# EAGLE design Versie 3 (EAGLE 7.3.0)
CNAME: PCB Christmas tree; CREVISION: 4; DESIGNER: Balint Balazs
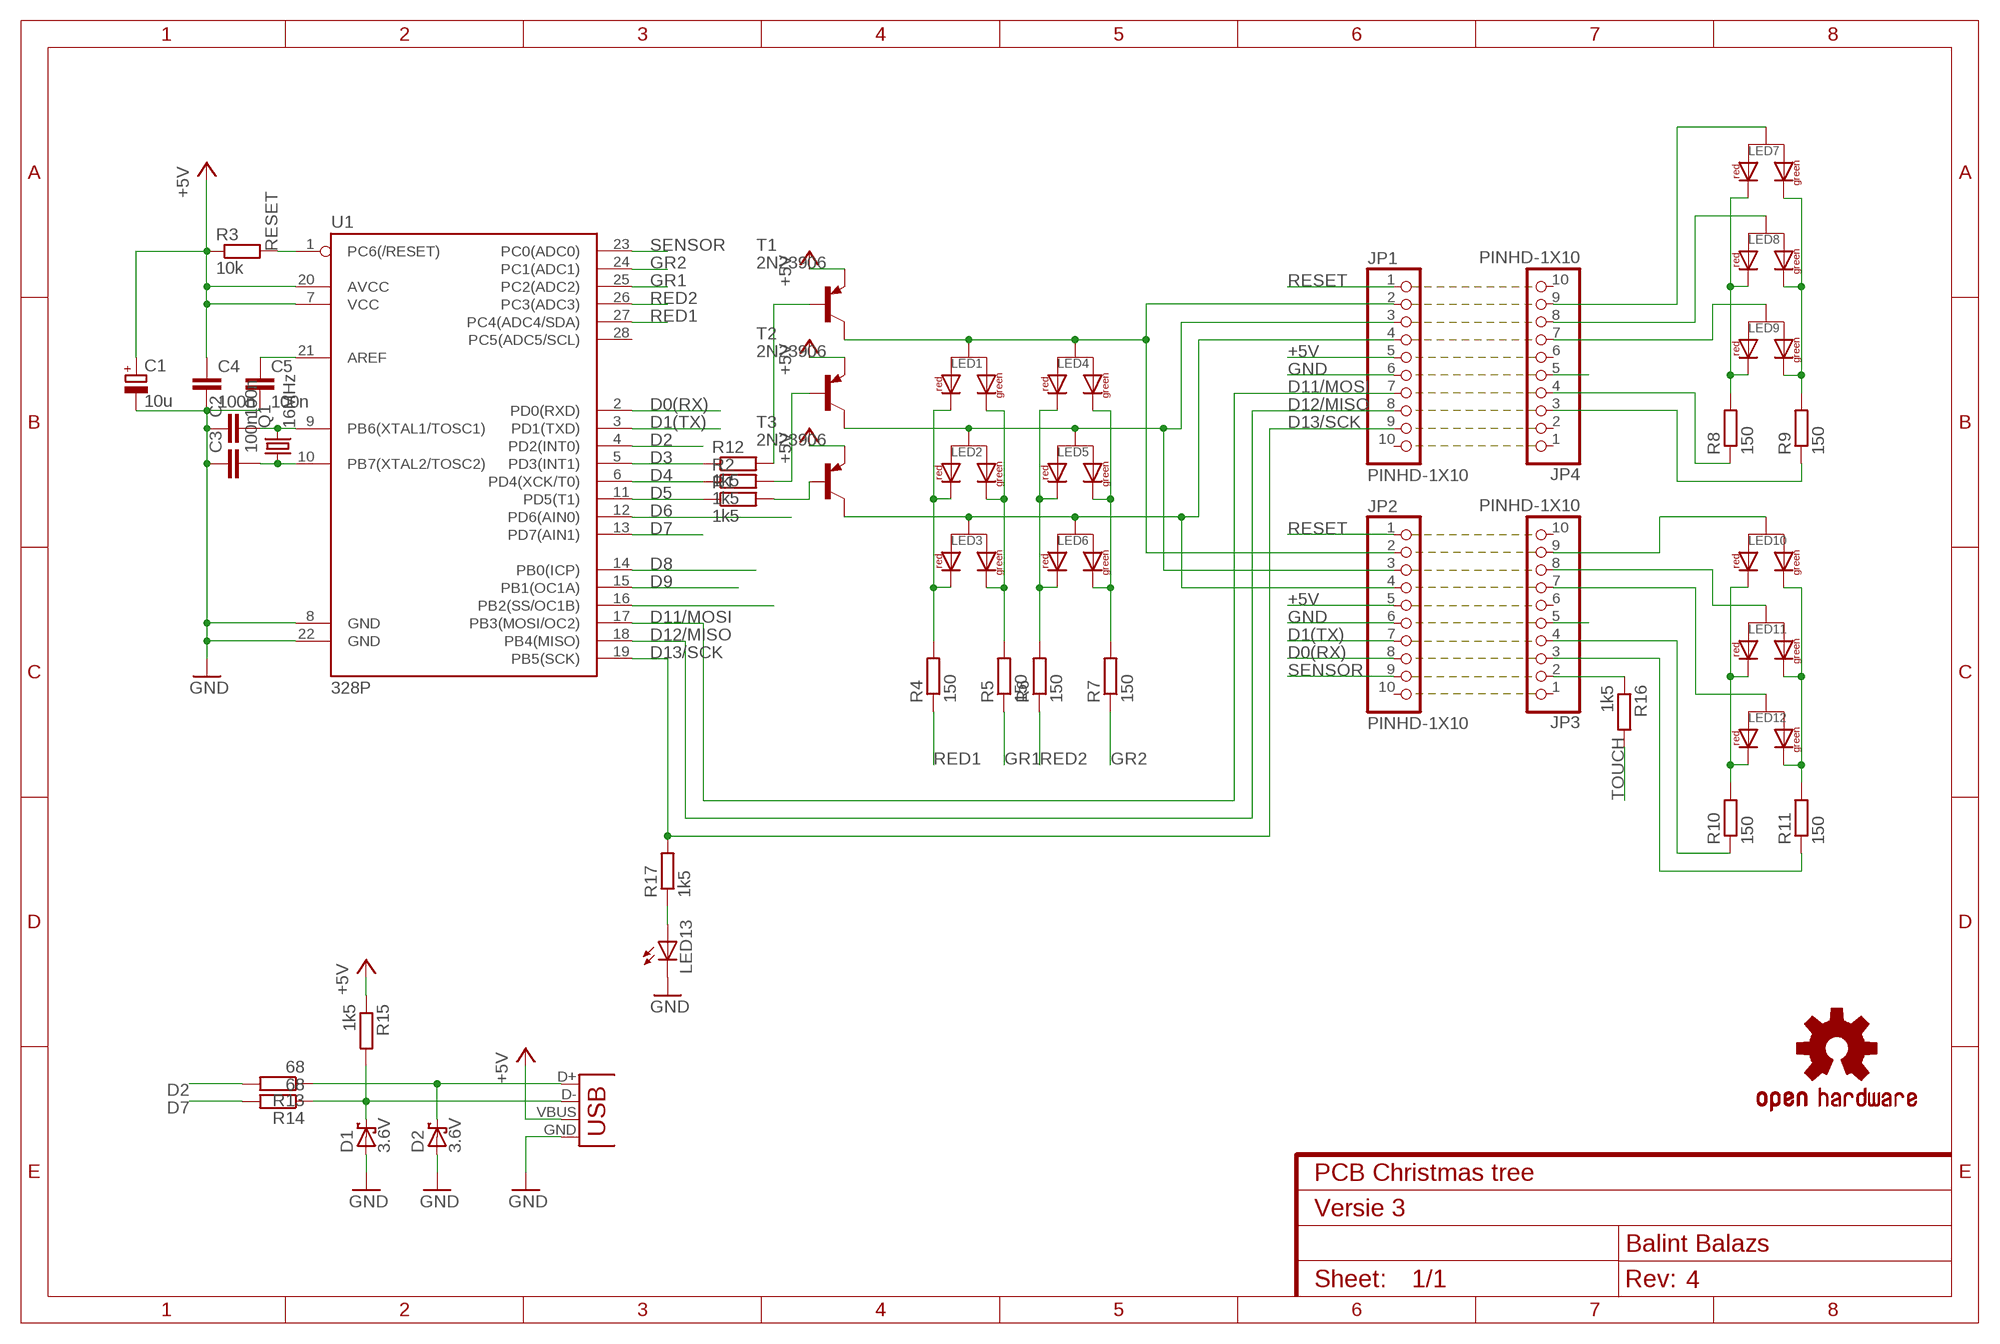
[diagram p0: schematic, sheet 1]

## Parts
C1  10u  CPOL-EUE2-4  [E2-4]
C2  100n  C-EU025-024X044  [C025-024X044]
C3  100n  C-EU025-024X044  [C025-024X044]
C4  100n  C-EU025-024X044  [C025-024X044]
C5  100n  C-EU025-024X044  [C025-024X044]
D1  3.6V  1N5817-B  [DO41-7.6]
D2  3.6V  1N5817-B  [DO41-7.6]
JP1  PINHD-1X10  [1X10-BIG]
JP2  PINHD-1X10  [1X10-BIG]
JP3  PINHD-1X10  [1X10-BIG]
JP4  PINHD-1X10  [1X10-BIG]
LED1  KPBA-3010SURKCGKC3MM  [3MMLED]
LED2  KPBA-3010SURKCGKC3MM  [3MMLED]
LED3  KPBA-3010SURKCGKC3MM  [3MMLED]
LED4  KPBA-3010SURKCGKC3MM  [3MMLED]
LED5  KPBA-3010SURKCGKC3MM  [3MMLED]
LED6  KPBA-3010SURKCGKC3MM  [3MMLED]
LED7  KPBA-3010SURKCGKC3MM  [3MMLED]
LED8  KPBA-3010SURKCGKC3MM  [3MMLED]
LED9  KPBA-3010SURKCGKC3MM  [3MMLED]
LED10  KPBA-3010SURKCGKC3MM  [3MMLED]
LED11  KPBA-3010SURKCGKC3MM  [3MMLED]
LED12  KPBA-3010SURKCGKC3MM  [3MMLED]
LED13  LED5MM  [LED5MM]
LOGO1  OSHW-LOGOM  [OSHW-LOGO-M]
Q1  16MHz  CRYSTALHC49S  [HC49/S]
R1  1k5  R-EU_0204/7  [0204/7]
R2  1k5  R-EU_0204/7  [0204/7]
R3  10k  R-EU_0204/7  [0204/7]
R4  150  R-EU_0204/7  [0204/7]
R5  150  R-EU_0204/7  [0204/7]
R6  150  R-EU_0204/7  [0204/7]
R7  150  R-EU_0204/7  [0204/7]
R8  150  R-EU_0204/7  [0204/7]
R9  150  R-EU_0204/7  [0204/7]
R10  150  R-EU_0204/7  [0204/7]
R11  150  R-EU_0204/7  [0204/7]
R12  1k5  R-EU_0204/7  [0204/7]
R13  68  R-EU_0204/7  [0204/7]
R14  68  R-EU_0204/7  [0204/7]
R15  1k5  R-EU_0204/7  [0204/7]
R16  1k5  R-EU_0204/7  [0204/7]
R17  1k5  R-EU_0204/7  [0204/7]
T1  2N23906  PNP  [TO92-STRAIGHT]
T2  2N23906  PNP  [TO92-STRAIGHT]
T3  2N23906  PNP  [TO92-STRAIGHT]
U1  328P  ATMEGA328P_PDIP  [DIP28]
X1  USBMINITHT  [USB-MINIB-THT]

## Nets
+5V: C1.+ C4.1 JP1.5 JP2.5 R3.1 R15.1 T1.E T2.E T3.E U1.7(VCC) U1.20(AVCC) X1.VBUS
D0(RX): JP2.8 U1.2(PD0(RXD))
D1(TX): JP2.7 U1.3(PD1(TXD))
D2: R13.2 U1.4(PD2(INT0))
D3: R12.1 U1.5(PD3(INT1))
D4: R2.1 U1.6(PD4(XCK/T0))
D5: R1.1 U1.11(PD5(T1))
D6: U1.12(PD6(AIN0))
D7: R14.2 U1.13(PD7(AIN1))
D8: U1.14(PB0(ICP))
D9: U1.15(PB1(OC1A))
D11: U1.16(PB2(SS/OC1B))
D11/MOSI: JP1.7 U1.17(PB3(MOSI/OC2))
D12/MISO: JP1.8 U1.18(PB4(MISO))
D13/SCK: JP1.9 R17.2 U1.19(PB5(SCK))
GND: C1.- C2.1 C3.1 C4.2 C5.2 D1.A D2.A JP1.6 JP2.6 LED13.K(C) U1.8(GND) U1.22(GND) X1.GND
GND2: JP3.5
GND3: JP4.5
GR1: R5.1 U1.25(PC2(ADC2))
GR2: R7.1 U1.24(PC1(ADC1))
N$1: R12.2 T1.B
N$2: R2.2 T2.B
N$3: JP3.7 LED12.+
N$4: R1.2 T3.B
N$5: D2.C R13.1 X1.D+
N$6: D1.C R14.1 R15.2 X1.D-
N$7: JP1.2 JP2.2 LED1.+ LED4.+ T1.C
N$8: LED13.A R17.1
N$9: JP1.3 JP2.3 LED2.+ LED5.+ T2.C
N$10: JP1.4 JP2.4 LED3.+ LED6.+ T3.C
N$11: LED1.-2 LED2.-2 LED3.-2 R5.2
N$12: LED4.-2 LED5.-2 LED6.-2 R7.2
N$13: LED4.-1 LED5.-1 LED6.-1 R6.2
N$14: LED1.-1 LED2.-1 LED3.-1 R4.2
N$15: LED7.-1 LED8.-1 LED9.-1 R8.2
N$16: LED7.-2 LED8.-2 LED9.-2 R9.2
N$17: LED10.-1 LED11.-1 LED12.-1 R10.2
N$18: LED10.-2 LED11.-2 LED12.-2 R11.2
N$19: JP4.7 LED9.+
N$20: JP3.2 R16.1
N$21: C2.2 Q1.2 U1.9(PB6(XTAL1/TOSC1))
N$22: C3.2 Q1.1 U1.10(PB7(XTAL2/TOSC2))
N$27: C5.1 U1.21(AREF)
N$28: JP3.4 R10.1
N$29: JP3.3 R11.1
N$31: JP3.8 LED11.+
N$32: JP3.9 LED10.+
N$34: JP4.4 R8.1
N$35: JP4.3 R9.1
N$37: JP4.8 LED8.+
N$38: JP4.9 LED7.+
RED1: R4.1 U1.27(PC4(ADC4/SDA))
RED2: R6.1 U1.26(PC3(ADC3))
RESET: JP1.1 JP2.1 R3.2 U1.1(PC6(/RESET))
SENSOR: JP2.9 U1.23(PC0(ADC0))
TOUCH: R16.2
Unconnected: JP1.10 JP2.10 JP3.1 JP3.6 JP3.10 JP4.1 JP4.2 JP4.6 JP4.10 U1.28(PC5(ADC5/SCL))

## Library data of the parts
C1 = rcl:CPOL-EU: POLARIZED CAPACITOR, European symbol
C2-C5 = resistor:C-EU: CAPACITOR, European symbol
D1 D2 = diode:1N581*: 1.0A SCHOTTKY BARRIER RECTIFIER Source: http://www.diodes.com/datasheets/ds23001.pdf
JP1-JP4 = adafruit:PINHD-1X10: Pin header 1x10 0.1" spacing With round pins
LED1-LED12 = pcb_xmas_custom_components:KPBA-3010SURKCGKC
LED13 = led:LED: LED OSRAM: - CHIPLED LG R971, LG N971, LY N971, LG Q971, LY Q971, LO R971, LY R971 LH N974, LH R974 LS Q976, LO Q976, LY Q976 LO Q996 - Hyper CHIPLED LW Q18S LB Q993, LB Q99A, LB R99A - SideLED LS A670, LO A670, LY A670, LG A670, LP A670 LB A673, LV A673, LT A673, LW A673 LH A674 LY A675 LS A676, LA A676, LO A676, LY A676, LW A676 LS A679, LY A679, LG A679 - Hyper Micro SIDELED® LS Y876, LA Y876, LO Y876, LY Y876 LT Y87S - SmartLED LW L88C, LW L88S LB L89C, LB L89S, LG L890 LS L89K, LO L89K, LY L89K LS L896, LA L896, LO L896, LY L896 - TOPLED LS T670, LO T670, LY T670, LG T670, LP T670 LSG T670, LSP T670, LSY T670, LOP T670, LYG T670 LG T671, LOG T671, LSG T671 LB T673, LV T673, LT T673, LW T673 LH T674 LS T676, LA T676, LO T676, LY T676, LB T676, LH T676, LSB T676, LW T676 LB T67C, LV T67C, LT T67C, LS T67K, LO T67K, LY T67K, LW E67C LS E67B, LA E67B, LO E67B, LY E67B, LB E67C, LV E67C, LT E67C LW T67C LS T679, LY T679, LG T679 LS T770, LO T770, LY T770, LG T770, LP T770 LB T773, LV T773, LT T773, LW T773 LH T774 LS E675, LA E675, LY E675, LS T675 LS T776, LA T776, LO T776, LY T776, LB T776 LHGB T686 LT T68C, LB T68C - Hyper Mini TOPLED® LB M676 - Mini TOPLED Santana® LG M470 LS M47K, LO M47K, LY M47K Source: http://www.osram.convergy.de LUXEON: - LUMILED® LXK2-PW12-R00, LXK2-PW12-S00, LXK2-PW14-U00, LXK2-PW14-V00 LXK2-PM12-R00, LXK2-PM12-S00, LXK2-PM14-U00 LXK2-PE12-Q00, LXK2-PE12-R00, LXK2-PE12-S00, LXK2-PE14-T00, LXK2-PE14-U00 LXK2-PB12-K00, LXK2-PB12-L00, LXK2-PB12-M00, LXK2-PB14-N00, LXK2-PB14-P00, LXK2-PB14-Q00 LXK2-PR12-L00, LXK2-PR12-M00, LXK2-PR14-Q00, LXK2-PR14-R00 LXK2-PD12-Q00, LXK2-PD12-R00, LXK2-PD12-S00 LXK2-PH12-R00, LXK2-PH12-S00 LXK2-PL12-P00, LXK2-PL12-Q00, LXK2-PL12-R00 Source: www.luxeon.com KINGBRIGHT: KA-3528ASYC Source: www.kingbright.com
LOGO1 = SparkFun-Aesthetics:OSHW-LOGO: Open Source Hardware Logo This logo indicates the piece of hardware it is found on incorporates a OSHW license and/or adheres to the definition of open source hardware found here: http://freedomdefined.org/OSHW
Q1 = adafruit:CRYSTAL: CRYSTAL; OC_FARNELL: 1667008; OC_NEWARK: unknown
R1 R2 R12 = rcl:R-EU_: RESISTOR, European symbol
R3-R11 R13-R17 = resistor:R-EU_: RESISTOR, European symbol
T1-T3 = to92:PNP
U1 = SparkFun-IC-Microcontroller:ATMEGA328P_PDIP: Atmel 328P Through hole ATMEGA328P uC used in the Arduino 32kb flash, 1k EEPROM, 2k SRAM Datasheet <http://www.sparkfun.com/datasheets/Components/SMD/ATMega328.pdf> SparkFun Products Storefront component: AVR 28 Pin 20MHz 32K 6A/D - ATMega328P <https://www.sparkfun.com/products/9061> (COM-09061) SparkFun Simon Says - Through-Hole Soldering Kit <https://www.sparkfun.com/products/10547> (KIT-10547) SparkFun Learn to Solder - Simon Says <https://www.sparkfun.com/products/13708> (KIT-13708) SparkFun BigTime Watch Kit <https://www.sparkfun.com/products/11734> (KIT-11734) SparkFun ClockIt <https://www.sparkfun.com/products/10930> (KIT-10930) SparkFun Serial Enabled LCD Kit <https://www.sparkfun.com/products/10097> (LCD-10097) SparkFun Simon Tilts - Through Hole Soldering Kit <https://www.sparkfun.com/products/12634> (KIT-12634) SparkFun Frequency Counter Kit <https://www.sparkfun.com/products/10140> (KIT-10140) FabFM Radio Kit <https://www.sparkfun.com/products/11043> (KIT-11043) SparkFun Binary Blaster Kit <https://www.sparkfun.com/products/12037> (KIT-12037) SparkFun Metro-Gnome <https://www.sparkfun.com/products/9236> (KIT-09236) ATmega328 with Arduino Optiboot (Uno) <https://www.sparkfun.com/products/10524> (DEV-10524); PROD_ID: IC-09136
X1 = usb:USB: USB Connectors USB-B-PTH is fully proven SKU : PRT-00139 USB-miniB is fully proven SKU : PRT-00587 USB-A-PCB is untested. USB-A-H is throughly reviewed, but untested. Spark Fun Electronics SKU : PRT-00437 USB-B-SMT is throughly reviewed, but untested. Needs silkscreen touching up. USB-A-S has not been used/tested USB-MB-H has not been used/tested

## Net classes
0 default: clearance 0.205 mm

## Board
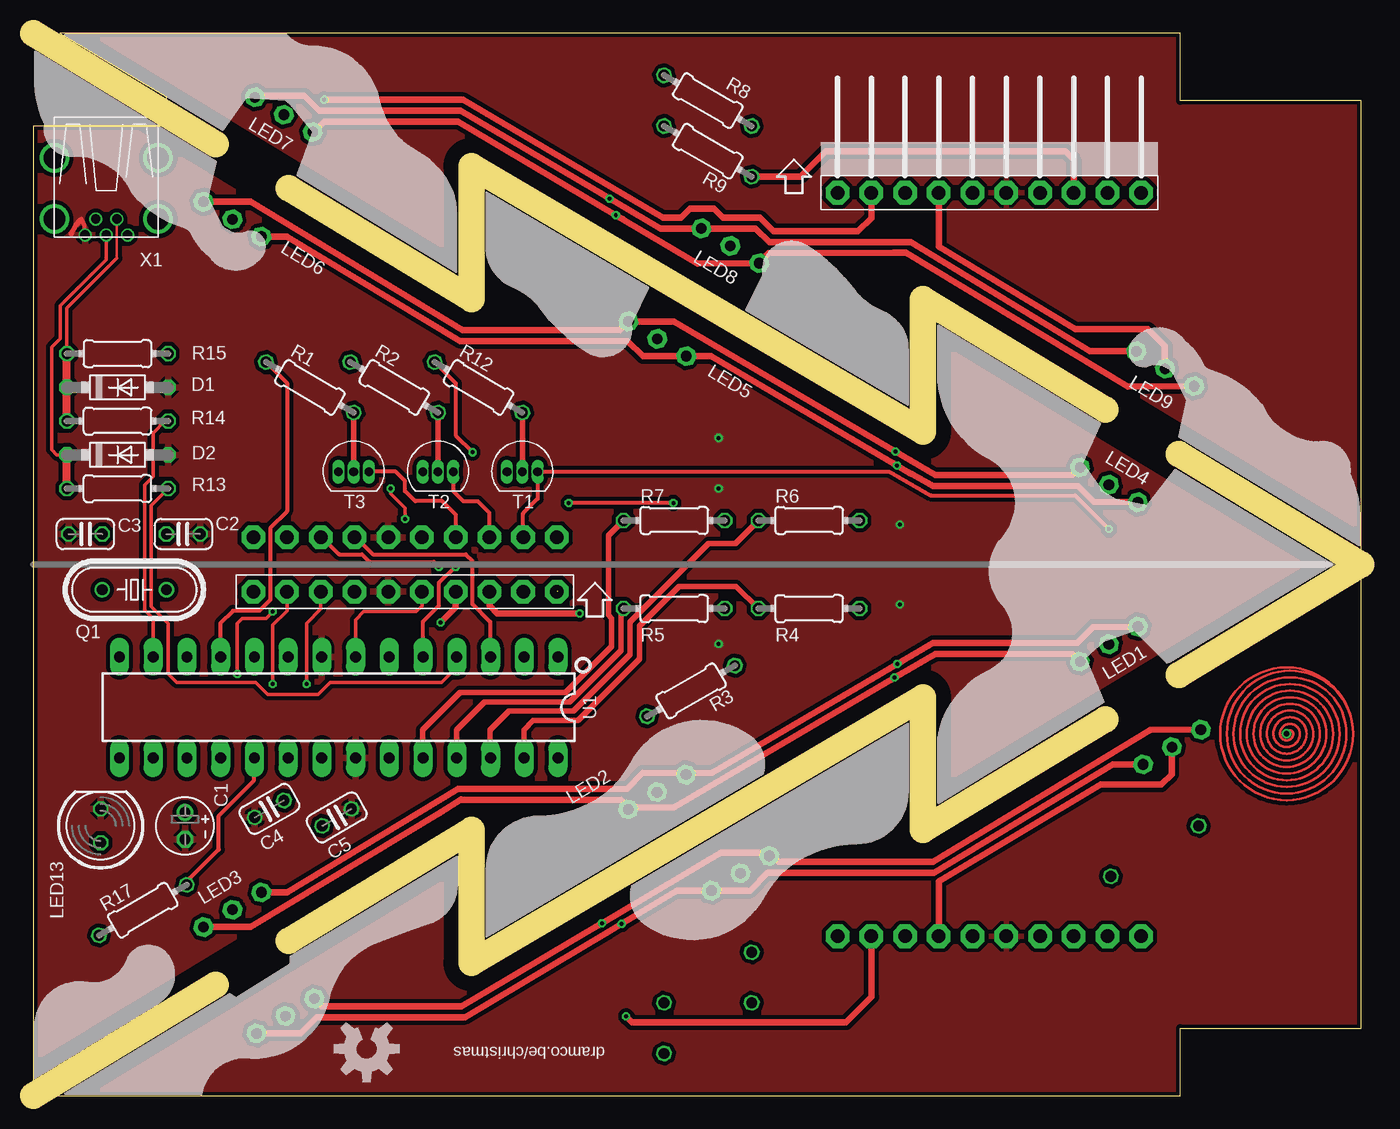
[diagram p1: board, top side]
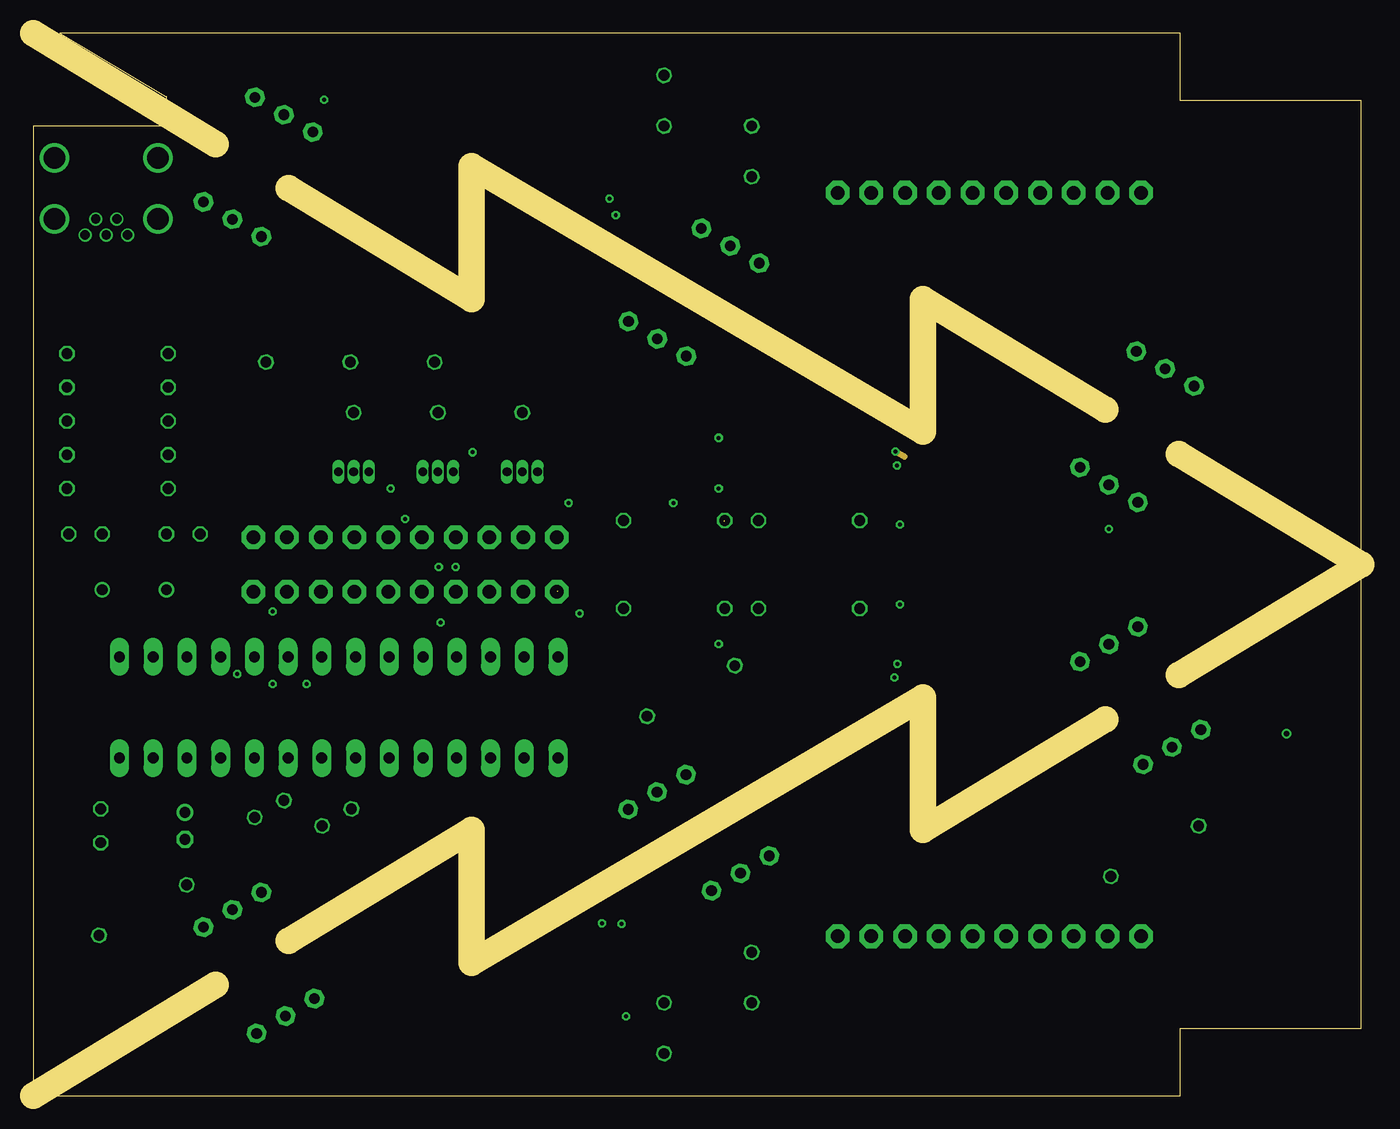
[diagram p2: board, inner layer Route2]
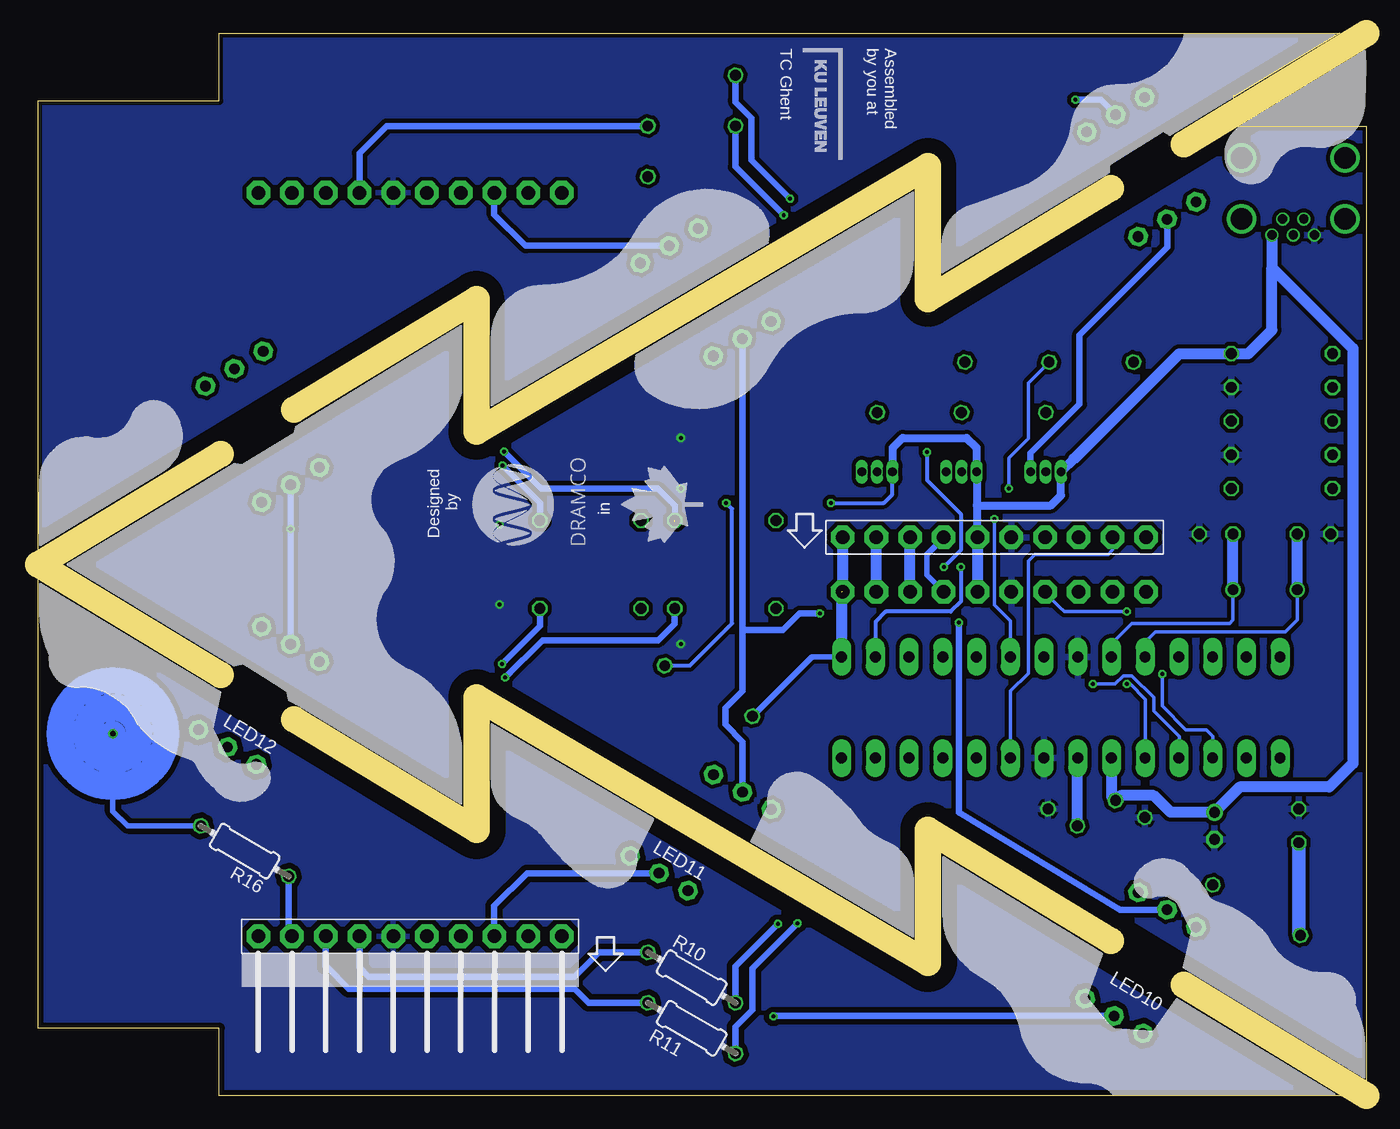
[diagram p3: board, bottom side, seen from below]

Size 100 x 80.01 mm. Coordinates in mm from the lower left corner, seen from the top.
Outline: 2,80 9.95,75.25 10,75.25 10,73 0,73 0,0 86.36,0 86.36,5.08 100,5.08 100,74.92 86.36,74.92 86.36,80.01 2,80
Copper layers (1*16): Top 0.035mm / dielectric 1.5mm / Bottom 0.035mm
Design rules "Seeedstudio DRU (met aanpassing)": minimum track width 6mil, minimum drill 0.3mm, track to track 6mil, track to pad 6mil, pad to pad 6mil, via to via 6mil, smd to smd 0mil, copper to edge 10mil, drill to drill 10mil, minimum pad ring 2mil, minimum via ring 6mil, stop-mask expansion 2mil, vias tented up to drill 100mil, thermal gap 10mil
tRestrict: 10 lines
bRestrict: 10 lines
Milling: 14 lines

### Footprints (pad centres in the part's own frame; a part is rotated, then mirrored left to right if it is on the bottom)
E2-4 = drill 0.813 pad 1.27: + -1.016,0 | drill 0.813 pad 1.27 octagon: - 1.016,0
C025-024X044 = drill 0.813 octagon: 1 -1.27,0; 2 1.27,0
DO41-7.6 = drill 0.813 octagon: A 3.81,0; C -3.81,0
1X10-BIG = drill 1.016 pad 1.778 octagon: 1 -11.43,0; 2 -8.89,0; 3 -6.35,0; 4 -3.81,0; 5 -1.27,0; 6 1.27,0; 7 3.81,0; 8 6.35,0; 9 8.89,0; 10 11.43,0
3MMLED = drill 0.8 pad 1.422 octagon: + 0,0; -1 -2.54,0; -2 2.54,0
LED5MM = drill 0.813 octagon: A -1.27,0; K 1.27,0
HC49/S = drill 0.813: 1 -2.413,0; 2 2.413,0
0204/7 = drill 0.813 octagon: 1 -3.81,0; 2 3.81,0
TO92-STRAIGHT = drill 0.65 pad 0.635 long: B 0,0; C 1.15,0; E -1.15,0
DIP28 = drill 0.813 pad 1.422 long: 1 -16.51,-3.81; 2 -13.97,-3.81; 3 -11.43,-3.81; 4 -8.89,-3.81; 5 -6.35,-3.81; 6 -3.81,-3.81; 7 -1.27,-3.81; 8 1.27,-3.81; 9 3.81,-3.81; 10 6.35,-3.81; 11 8.89,-3.81; 12 11.43,-3.81; 13 13.97,-3.81; 14 16.51,-3.81; 15 16.51,3.81; 16 13.97,3.81; 17 11.43,3.81; 18 8.89,3.81; 19 6.35,3.81; 20 3.81,3.81; 21 1.27,3.81; 22 -1.27,3.81; 23 -3.81,3.81; 24 -6.35,3.81; 25 -8.89,3.81; 26 -11.43,3.81; 27 -13.97,3.81; 28 -16.51,3.81
USB-MINIB-THT = drill 0.7: D+ 3.83,0; D- 2.63,0.8; GND 3.83,-1.6; ID 2.63,-0.8; VBUS 3.83,1.6 | drill 1.6: P$1 2.63,3.9; P$2 2.63,-3.9; P$6 -1.97,-3.9; P$7 -1.97,3.9

### Placement (x,y rotation side)
C1  11.43,20.32 270 top
C2  11.3,42.29 180 top
C3  3.94,42.29 0 top
C4  17.78,21.59 210 top
C5  22.86,20.95 30 top
D1  6.35,53.34 0 top
D2  6.35,48.26 0 top
JP1  28,37.95 180 top
JP2  28,42.05 0 bottom
JP3  72,12 0 bottom
JP4  72,68 180 top
LED1  81,34 211 top
LED2  46.98,22.87 211 top
LED3  15,14 211 top
LED4  81,46 149 top
LED5  47,57 149 top
LED6  15,66 149 top
LED7  18.87,73.87 329 top
LED8  52.49,64 329 top
LED9  85.24,54.75 329 top
LED10  19,6 149 bottom
LED11  53.25,16.75 149 bottom
LED12  85.75,26.25 149 bottom
LED13  5.08,20.32 90 top
LOGO1  25.11,3.53 180 top
Q1  7.62,38.1 0 top
R1  20.83,53.34 330 top
R2  27.18,53.34 330 top
R3  49.53,30.48 210 top
R4  58.42,36.68 0 top
R5  48.26,36.68 0 top
R6  58.42,43.32 0 top
R7  48.26,43.32 0 top
R8  50.8,74.93 150 top
R9  50.8,71.12 150 top
R10  50.8,8.89 330 bottom
R11  50.8,5.08 330 bottom
R12  33.53,53.34 330 top
R13  6.35,45.72 0 top
R14  6.35,50.8 0 top
R15  6.35,55.88 180 top
R16  84.45,18.41 150 bottom
R17  8.26,13.97 30 top
T1  36.83,46.99 0 top
T2  30.48,46.99 0 top
T3  24.13,46.99 0 top
U1  23,29.24 180 top
X1  5.5,68.65 270 top

### Tracks (layer width: path | path; a pad name or v marks a point on that pad's centre or on a via)
+5V  (via drill 0.3)
  Top 0.254: U1.7 24.27,35.83 24.89,36.45 28.83,36.45 29.27,36.89 JP1.5
  Top 0.305: v48.2,44.64 v40.32,44.64
  Bottom 0.305: R3.1 50.93,32.38 47.75,35.56 47.75,44.2 v48.2,44.64 | v40.32,44.64 36.32,44.64 35.69,45.28 T1.E
  Bottom 0.406: 1.14,54.99 1.14,51.94 1.02,52.07
  Bottom 0.61: 29.33,44.45 23.73,44.45 22.98,45.2 T3.E | 29.33,44.45 T2.E 29.33,48.77 30.1,49.53 34.92,49.53 35.68,48.77 T1.E | 29.33,44.45 29.33,42.11 JP2.5
  Bottom 0.762: 22.04,47.94 T3.E
  Bottom 0.813: X1.VBUS 7.1,62.34 | 7.1,62.34 1.02,56.26 1.02,52.07 1.02,25.02 2.79,23.24 9.53,23.24 C1.+ 14.73,21.34 16,22.61 18.5,22.61 C4.1 19.19,22.54 U1.20 | JP2.5 JP1.5 | 7.1,62.34 7.11,62.33 7.11,57.66 8.89,55.88 R15.1 14.1,55.88 22.04,47.94
D0(RX)  (via drill 0.3)
  Top 0.305: JP2.8 21.77,42.05 23.05,40.77 24.77,40.77 25.34,40.2 30.16,40.2 v30.54,39.81
  Bottom 0.305: U1.2 36.96,33.82 36.96,35.69 36.2,36.45 31.3,36.45 30.54,37.21 v30.54,39.81
D1(TX)
  Top 0.305: JP2.7 24.31,42.05 25.59,40.77 32.58,40.77 33.08,40.26 33.08,37.02 34.42,35.69 34.42,33.82 U1.3
D2
  Top 0.254: U1.4 31.88,33.8 31.88,32.26 30.73,31.11 22.35,31.11 21.46,30.23 17.65,30.23 16.76,31.11 10.79,31.11 10.16,31.75 10.16,35.56 8.89,36.83 8.89,44.45 R13.2
D3  (via drill 0.3)
  Top 0.305: R12.1 31.81,53.66 31.81,49.72 v33.08,48.45 | v31.81,39.81 31.75,39.81 30.54,38.61 30.54,36.89 29.34,35.69 29.34,33.82 U1.5
  Bottom 0.305: v33.08,48.45 33.08,46.35 30.54,43.81 30.54,41.08 v31.81,39.81
D4  (via drill 0.3)
  Top 0.254: v28,43.43 28,44.26 26.92,45.34 v26.92,45.72
  Bottom 0.254: U1.6 26.81,35.76 28,36.96 v28,43.43 | v26.92,45.72 26.92,48.01 25.46,49.47 25.46,53.66 R2.1
D5
  Top 0.305: R1.1 19.11,53.66 19.11,44.01 17.84,42.74 17.84,37.34 17.02,36.51 15.05,36.51 14.1,35.56 14.1,33.82 U1.11
D7
  Top 0.254: 9.91,50.8 9.02,49.91 9.02,46.61 8.38,45.97 8.38,36.58 9.02,35.94 9.02,33.82 U1.13
  Top 0.406: R14.2 9.91,50.8
D11/MOSI  (via drill 0.3)
  Top 0.254: v15.37,31.75 15.37,35.56 15.75,35.94 17.53,35.94 v18.03,36.45
  Bottom 0.254: JP1.7 24.19,37.91 22.99,36.7 22.86,36.58 22.73,36.45 v18.03,36.45 | U1.17 11.56,26.2 11.56,27.05 12.06,27.56 13.59,27.56 15.37,29.34 v15.37,31.75
D12/MISO  (via drill 0.3)
  Top 0.254: JP1.8 21.65,36.64 20.57,35.56 v20.57,30.99
  Bottom 0.254: U1.18 14.1,26.2 14.1,27.05 16,28.96 16,29.97 17.65,31.62 18.29,31.62 18.92,30.99 v20.57,30.99
D13/SCK  (via drill 0.3)
  Top 0.254: JP1.9 19.11,36.51 18.03,35.43 v18.03,30.99
  Top 0.305: R17.2 11.55,16.13 13.97,18.54 13.97,21.08 16.64,23.75 16.64,26.18 U1.19
  Bottom 0.254: U1.19 16.64,26.2 16.64,29.84 17.78,30.99 v18.03,30.99
GND  (via drill 0.3)
  Top 0.305: X1.GND 3.9,64.93 3.87,65.47 3.62,66.04 3.56,65.91
  Top 0.406: 3.56,65.91 3.24,65.6 2.86,64.9
  other vias: 51.62,49.54 65.27,43 51.62,34 65.27,37 51.62,45.73
  pour Bottom (isolate 0.305): -13,90 125,91 125,-13 -13,-14
  pour Top (isolate 0.305): -4,86 106,86 106,-8 -4,-8
GND2
  pour Bottom (isolate 0.406): 109,52.16 109,-3 -17.24,-3
  pour Top (isolate 0.305): -20.97,-2.27 114,-1 114,58.24
GND3
  pour Bottom (isolate 0.305): -7,83 111,83 111,31 -7,31
  pour Top (isolate 0.305): -9,81 116,81 116,37 -9,37
GR1
  Top 0.406: R5.1 44.26,36.49 44.26,33.53 40.39,29.65 33.97,29.65 31.88,27.56 31.88,26.2 U1.25
GR2
  Top 0.406: R7.1 43.31,42.18 43.31,36.2 43.56,35.94 43.56,33.85 40.07,30.35 32.13,30.35 29.34,27.56 29.34,26.2 U1.24
N$1
  Top 0.406: T1.B R12.2
N$2
  Top 0.406: T2.B R2.2
N$3
  Top 0.508: JP3.7 68.19,16.12 68.2,16.13 80.39,23.43 84.96,23.43 85.72,24.19 85.72,25.73 LED12.+
N$4
  Top 0.406: T3.B R1.2
N$5
  Top 0.254: D2.C 1.78,48.26 1.4,48.64 1.4,56.39 2.03,57.02 2.03,59.5 5.5,62.97 X1.D+
  Top 0.61: R13.1 D2.C
N$6
  Top 0.178: 6.29,63.06 6.29,66.01
  Top 0.254: R15.2 2.54,59.31 6.29,63.06 | 6.29,66.01 X1.D-
  Top 0.61: R15.2 D1.C R14.1
N$7  (via drill 0.3)
  Top 0.305: JP2.2 36.89,43.88 37.98,44.97 T1.C 64.45,46.99 67.56,45.21 78.46,45.21 v81,42.67
  Bottom 0.508: LED4.+ v81,42.67 LED1.+
  Bottom 0.813: JP1.2 JP2.2
N$8
  Bottom 1.016: LED13.A 5.08,12.19 R17.1
N$9  (via drill 0.3)
  Top 0.305: T2.C 31.63,45.52 32.38,44.77 33.47,44.77 34.35,43.88 JP2.3
  Top 0.508: JP1.3 34.35,36.9 34.92,36.32 v41.15,36.32
  Bottom 0.508: 46.99,35.05 46.99,30.48 48.26,29.21 48.26,27.94 46.98,26.66 LED2.+ | 46.99,35.05 LED5.+ | v41.15,36.32 42.67,36.32 43.94,35.05 46.99,35.05
  Bottom 0.813: JP1.3 JP2.3
N$10  (via drill 0.3)
  Top 0.305: JP2.4 31.81,43.75 30.8,44.77 28.77,44.77 28,45.53 28,46.29 27.3,46.99 T3.C
  Top 0.508: v30.67,35.62 31.81,36.77 JP1.4
  Bottom 0.406: JP2.4 33.08,40.77 33.08,39.22 JP1.4
  Bottom 0.508: T3.C 25.28,48.38 21.59,52.07 21.59,57.28 14.99,63.88 14.99,65.99 LED6.+ | v30.67,35.62 30.67,21.34 18.61,14.03 18.57,14 LED3.+
N$11  (via drill 0.3)
  Top 0.508: 65.35,31.74 48.26,21.72 44.95,21.72 LED2.-2 44.83,21.59 44.83,21.72 44.26,22.29 32.24,22.29 32.23,22.3 30.67,21.34 16.38,12.7 LED3.-2 | 65.35,31.74 67.92,33.25 67.95,33.27 78.23,33.27 LED1.-2 | v64.84,31.48 65.35,31.74
  Bottom 0.508: R5.2 52.09,36.68 52.09,35.54 53.34,34.29 62.03,34.29 v64.84,31.48 64.57,31.75 64.52,31.81
N$12  (via drill 0.3)  (1 unrouted)
  Top 0.508: LED6.-2 16.38,67.31 32.32,57.66 44.17,57.66 | 44.17,57.66 LED5.-2 | 44.17,57.66 44.2,57.66 44.83,58.29 48.26,58.29 v64.93,48.51 67.94,46.74 78.23,46.74 78.8,47.31 LED4.-2
  Route2 0.508: v64.93,48.51 65.59,48.12
  Bottom 0.508: R7.2 52.15,43.32 | 52.07,43.24 52.07,44.45 53.34,45.72 62.14,45.72 v64.93,48.51
N$13  (via drill 0.3)
  Top 0.508: LED6.-1 19.13,64.69 19.18,64.64 32.13,56.83 44.77,56.83 45.91,55.69 LED5.-1 51.05,55.69 v65.05,47.46 65.99,46.9 66.17,46.8 67.63,45.97 67.75,45.91 78.68,45.91 79.88,44.7 83.17,44.7 LED4.-1
  Bottom 0.508: R6.2 62.23,44.64 v65.05,47.46
N$14  (via drill 0.3)
  Top 0.508: LED1.-1 79.82,35.31 78.61,34.1 67.75,34.1 65.47,32.75 v65.06,32.52 51.12,24.32 49.3,24.32 LED2.-1 49.02,24.31 45.9,24.31 44.7,23.11 32,23.11 19.11,15.3 19.11,15.31 LED3.-1
  Bottom 0.508: R4.2 62.23,35.35 v65.06,32.52
N$15  (via drill 0.3)
  Top 0.508: LED7.-1 16.7,75.24 16.76,75.31 20.39,75.31 21.53,74.17 32.19,74.17 42.78,67.91 | 42.78,67.91 47.24,65.28 LED8.-1 54.39,65.31 55.44,64.26 66.1,64.26 79.57,56.07 LED9.-1 | v43.39,67.55 42.78,67.91
  Bottom 0.508: R8.2 47.5,74.93 47.5,74.8 46.29,73.6 46.29,70.45 v43.39,67.55
N$16  (via drill 0.3)
  Top 0.508: LED7.-2 21.26,72.69 21.91,73.34 32,73.34 v43.87,66.33 | v43.87,66.33 50.04,62.67 LED8.-2 54.67,62.73 55.37,63.44 64.77,63.5 65.72,63.5 82.42,53.4 LED9.-2 | v43.87,66.33 44.42,66
  Bottom 0.508: R9.2 47.5,69.96 v43.87,66.33
N$17  (via drill 0.3)
  Top 0.508: LED10.-1 20.12,4.69 21.34,5.91 32.51,5.91 43.25,12.29 v44.32,12.92 48.45,15.43 LED11.-1 53.98,15.44 55.31,16.76 67.82,16.76 81.28,24.96 LED12.-1
  Bottom 0.508: v44.32,12.92 47.5,9.74 R10.2
N$18  (via drill 0.3)
  Top 0.508: LED10.-2 21.18,7.27 21.72,6.73 32.26,6.73 42.34,12.71 v42.82,12.99 51.75,18.29 55.18,18.29 LED11.-2 55.69,18.04 56.13,17.59 67.75,17.59 84.14,27.56 LED12.-2
  Bottom 0.508: v42.82,12.99 46.23,9.59 46.23,6.48 47.5,5.21 R11.2 | R11.2
N$19
  Top 0.508: JP4.7 68.19,63.95 68.2,63.94 78.49,57.72 83.95,57.72 85.22,56.45 85.22,54.77 LED9.+
N$20
  Bottom 0.406: 81.16,11.27 JP3.2
  Bottom 0.508: R16.1 81.16,12.27 JP3.2
N$21
  Bottom 0.254: U1.9 19.19,34.02 17.65,35.56 10.29,35.56 10.03,35.81 Q1.2
  Bottom 0.813: Q1.2 C2.2
N$22
  Bottom 0.254: U1.10 16.65,34.15 15.88,34.92 6.1,34.92 5.21,35.81 Q1.1
  Bottom 0.813: Q1.1 C3.2
N$27
  Bottom 0.813: C5.1 21.76,26.16 U1.21
N$28
  Bottom 0.508: JP3.4 75.82,10.99 75.82,9.65 75.12,8.95 59.63,8.95 57.78,10.79 R10.1
N$29
  Bottom 0.508: JP3.3 78.35,9.72 78.31,9.72 76.64,8.06 59.63,8.06 58.55,6.99 R11.1
N$31
  Bottom 0.508: LED11.+ 63.2,16.75 65.66,14.29 JP3.8
N$32  (via drill 0.3)
  Top 0.508: v44.64,5.97 45.09,5.52 61.21,5.52 63.12,7.43 63.12,10.99 JP3.9
  Bottom 0.508: LED10.+ 44.61,6 v44.64,5.97
N$34
  Bottom 0.508: R8.1 73.79,73.03 75.82,70.99 75.82,69.01 JP4.4
N$35
  Top 0.508: R9.1 57.78,69.22 59.69,71.12 77.72,71.12 78.36,70.48 78.36,69.01 JP4.3
N$37
  Bottom 0.508: LED8.+ 63.3,64 65.66,66.36 JP4.8
N$38  (via drill 0.3)
  Top 0.508: JP4.9 63.11,66.09 62.1,65.09 55.75,65.09 54.74,66.1 51.94,66.1 51.24,66.8 49.47,66.8 48.77,66.1 47.43,66.1 32.38,74.99 v21.91,74.99
  Bottom 0.508: v21.91,74.99 19.99,74.99 LED7.+
RED1
  Top 0.406: R4.1 52.94,38.35 48.64,38.35 45.66,35.37 45.66,32.89 41.02,28.26 37.66,28.26 36.96,27.56 36.96,26.2 U1.27
RED2
  Top 0.406: R6.1 52.88,41.59 50.86,41.59 44.96,35.69 44.96,33.21 40.7,28.96 35.81,28.96 34.42,27.56 34.42,26.2 U1.26
RESET  (1 unrouted)
  Bottom 0.406: U1.1 41.76,33.05 R3.2
  Bottom 0.813: JP2.1 JP1.1 | 39.51,37.96 U1.1
SENSOR
  Bottom 0.254: U1.23 26.81,30.47 25.46,31.81 25.46,40.26 24.96,40.77 19.43,40.77 19.11,41.08 JP2.9
TOUCH  (via drill 0.4)
  Top 0.2: v94.38,27.25 arc-90 94.63,27.5 arc-90 94.88,27.25 arc-180 93.88,27.25 arc-180 95.38,27.25 arc-180 93.38,27.25 arc-180 95.88,27.25 arc-180 92.88,27.25 arc-180 96.38,27.25 arc-180 92.38,27.25 arc-180 96.88,27.25 arc-180 91.88,27.25 arc-180 97.38,27.25 arc-180 91.38,27.25 arc-180 97.88,27.25 arc-180 90.88,27.25 arc-180 98.38,27.25 arc-180 90.38,27.25 arc-180 98.88,27.25 arc-180 89.88,27.25 arc-90 94.63,32 arc-90 99.38,27.25 | 99.38,27.25 arc-180 89.38,27.25 arc-180 99.38,27.25
  Bottom 0.406: 94.38,23.25 94.38,21.42 93.28,20.32 R16.2
  Bottom 2: 94.38,23.25 arc90 98.38,27.25 arc90 94.38,31.25 arc90 90.38,27.25 arc90 94.38,23.25 | 94.38,23.25 94.38,25.25 | 94.38,25.25 arc90 96.38,27.25 arc90 94.38,29.25 arc90 92.38,27.25 arc90 94.38,25.25 | 94.38,25.25 v94.38,27.25

### Text on the board
tPlace: dramco.be/christmas
bPlace: Assembled / by you at | TC Ghent | Designed / by | in